# EasyEDA Pro project PPD.epro

# Schematic Schematic1
Board Name: Board1; Create Date: 2026-01-21; Page Name: P1; Project Name: pdd; Schematic Name: Schematic1; Update Date: 2026-01-24; Company: EasyEDA.com; Page Size: A4; Version: V1.0
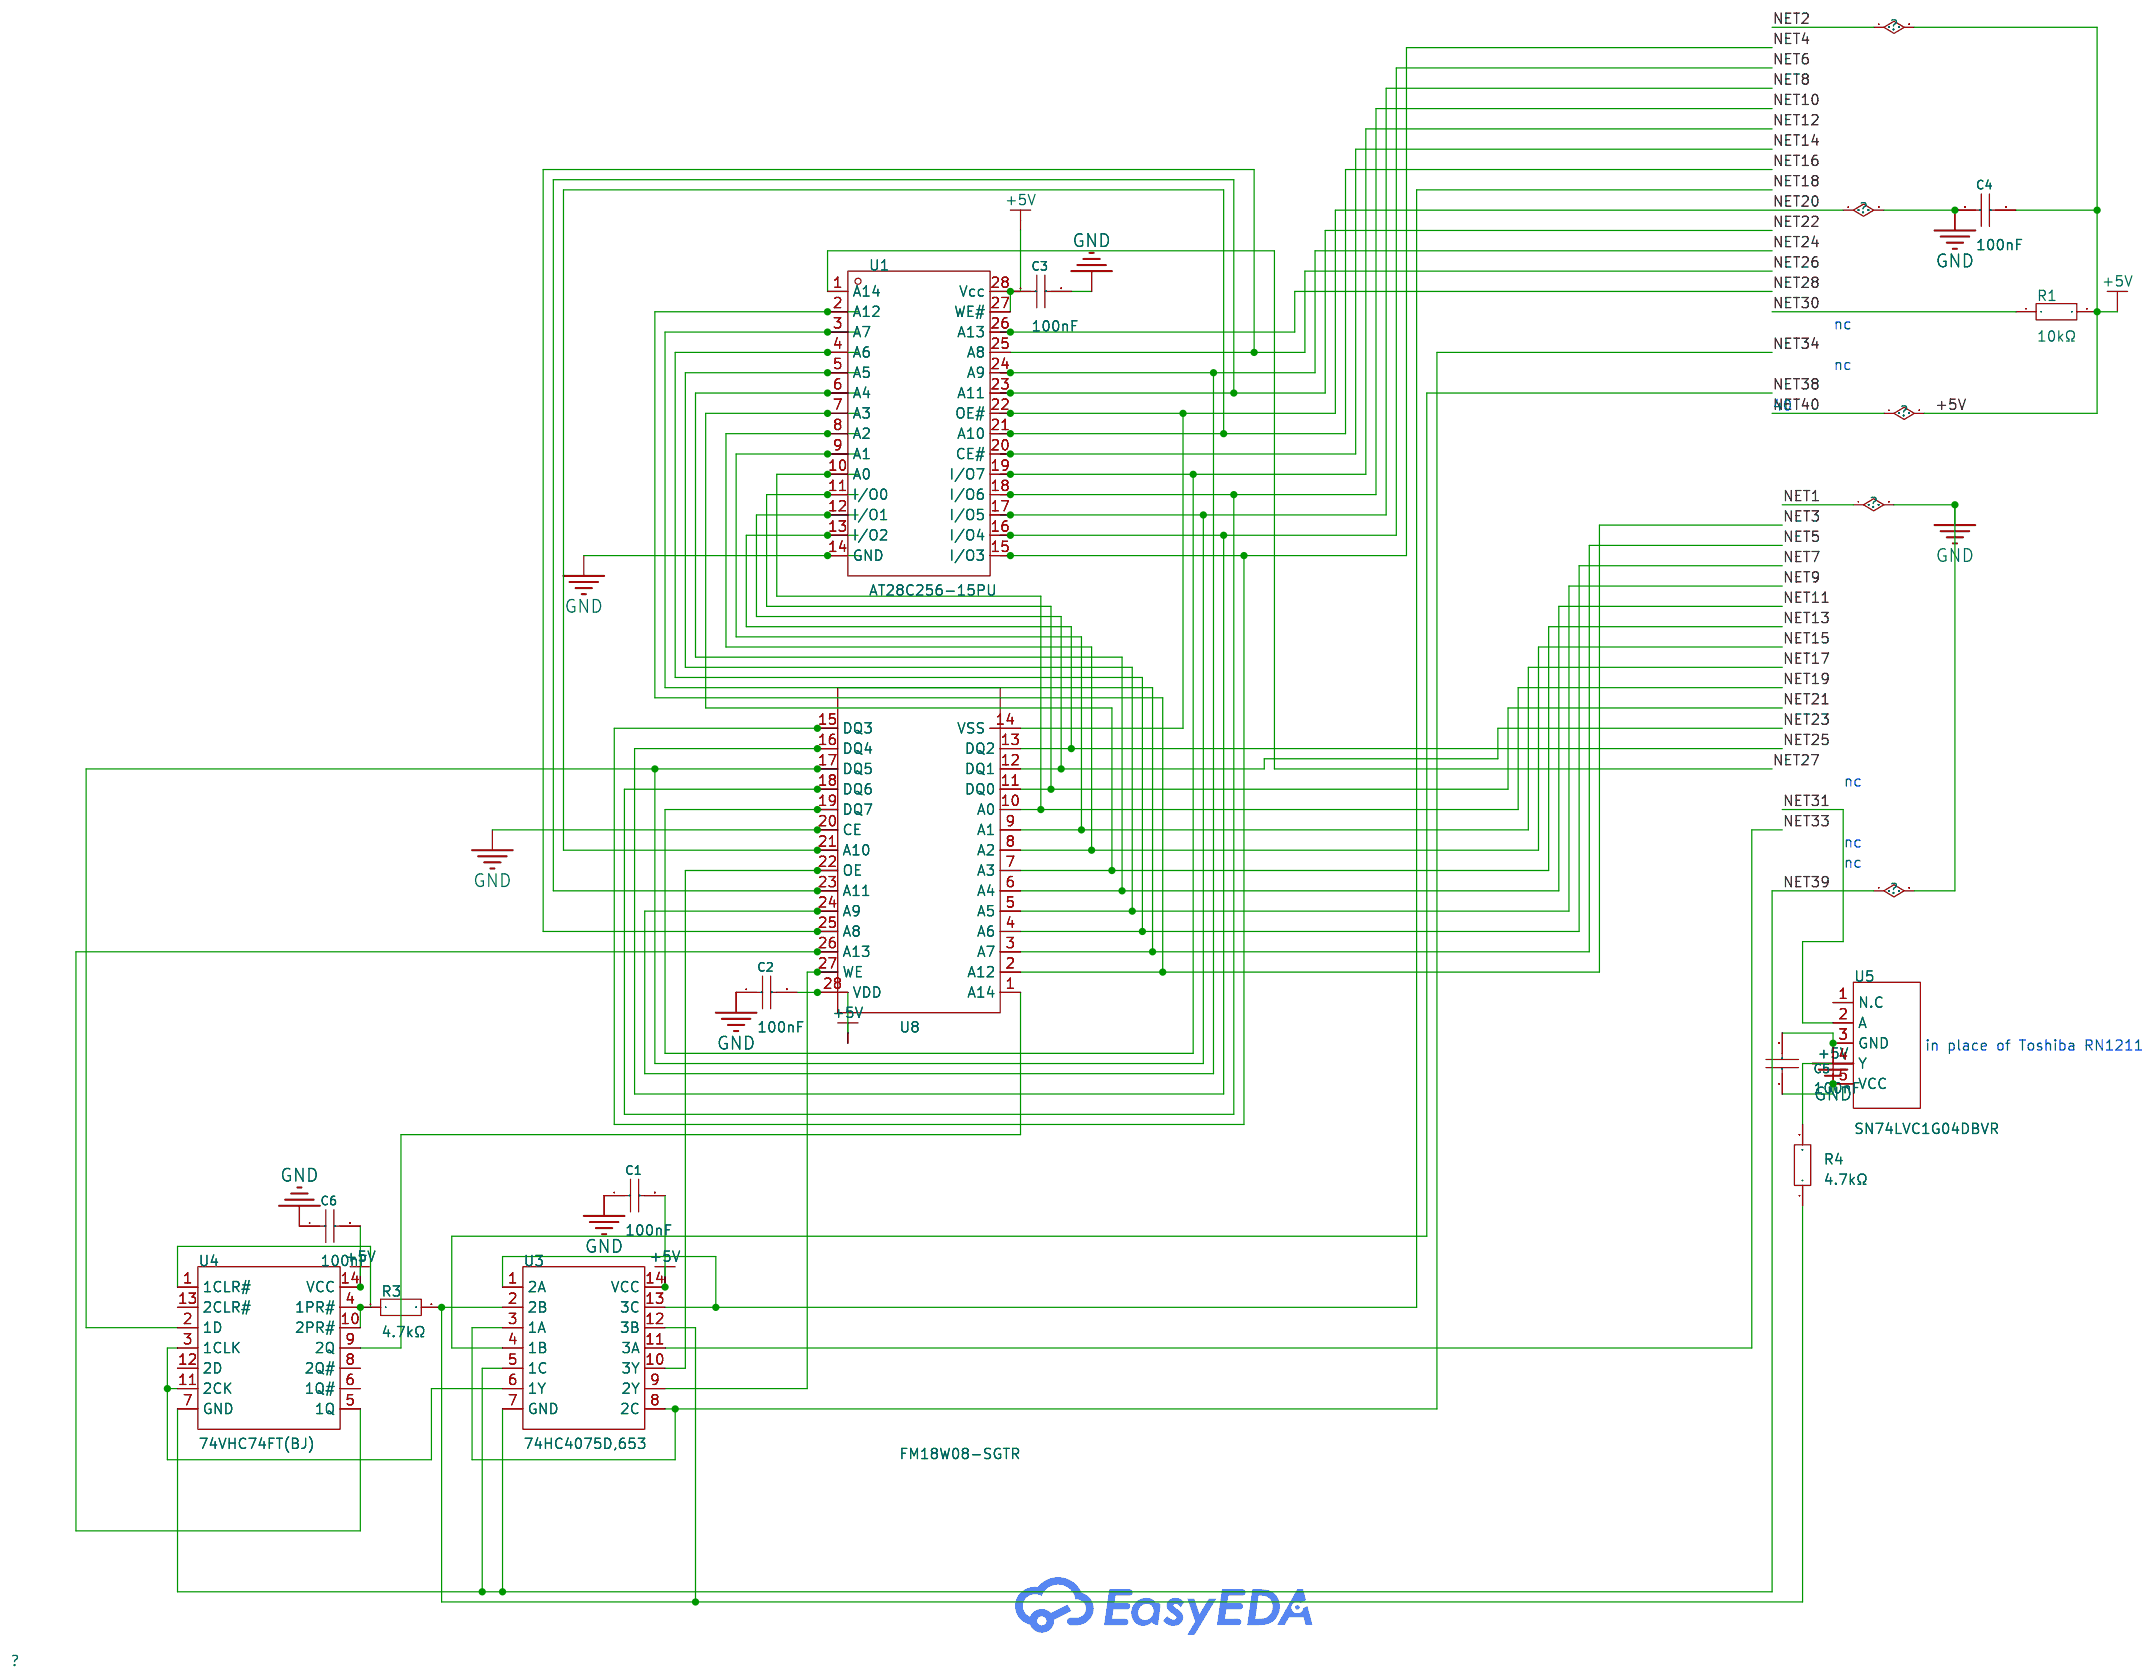
[diagram p0: schematic sheet]

## Parts
C1  100nF  [C0603]
C2  100nF  [C0603]
C3  100nF  [C0603]
C4  100nF  [C0603]
C5  100nF  [C0603]
C6  100nF  [C0603]
R1  10kΩ  [R0805]
R3  4.7kΩ  [R0805]
R4  4.7kΩ  [R0805]
U1  AT28C256-15PU  [PDIP-28_L37.0-W13.5-P2.54-LS15.6-BL]
U3  74HC4075D,653  [SO-14_L8.9-W3.9-P1.27-LS6.0-BL]
U4  74VHC74FT(BJ)  [TSSOP-14_L5.0-W4.4-P0.65-LS6.5-BL]
U5  SN74LVC1G04DBVR  [SOT-23-5_L3.0-W1.7-P0.95-LS2.8-BR]
U8  FM18W08-SGTR  [SOIC-28_L18.0-W7.5-P1.27-LS10.3-BL]

## Library data of the parts
C1-C6 = CL10B104JB8NNNC: Capacitance:100nF Tolerance:±5% Tolerance:±5% Voltage Rating:50V Temperature Coefficient:X7R; LCSC Part Name: 100nF ±5% 50V; Supplier Part: C24452; Manufacturer: SAMSUNG(三星); Supplier Footprint: 0603; JLCPCB Part Class: Extended Part; Datasheet: https://item.szlcsc.com/datasheet/CL10B104JB8NNNC/25192.html; Supplier: LCSC; Tolerance: ±5%; Voltage Rating: 50V; Temperature Coefficient: X7R
R1 = RT0805BRD0710KL: Type:Thin Film Resistor Resistance:10kΩ Tolerance:±0.1% Tolerance:±0.1% Power(Watts):125mW Voltage-Supply(Max):150V Temperature Coefficient:±25ppm/℃ Temperature Coefficient:±25ppm/℃ Operating Temperature:-55℃~+155℃ Operating Temperature:-55℃~+155℃; LCSC Part Name: 薄膜电阻 10kΩ ±0.1% 125mW; Supplier Part: C110775; Manufacturer: YAGEO(国巨); Supplier Footprint: 0805; JLCPCB Part Class: Extended Part; Datasheet: https://item.szlcsc.com/datasheet/RT0805BRD0710KL/112000.html; Supplier: LCSC; Type: Thin Film Resistor; Tolerance: ±0.1%; Power(Watts): 125mW; Voltage-Supply(Max): 150V; Temperature Coefficient: ±25ppm/℃; Operating Temperature: -55℃~+155℃
R3 R4 = 0805W8F4701T5E: Type:Thick Film Resistors Resistance:4.7kΩ Tolerance:±1% Tolerance:±1% Power(Watts): Overload Voltage (Max): Temperature Coefficient:±100ppm/℃ Temperature Coefficient:±100ppm/℃ Operating Temperature Range:-55℃~+155℃ Operating Temperature Range:-55℃~+155℃; LCSC Part Name: 4.7kΩ ±1% 125mW 厚膜电阻; Supplier Part: C17673; Manufacturer: UNI-ROYAL(厚声); Supplier Footprint: 0805; JLCPCB Part Class: Basic Part; Datasheet: https://atta.szlcsc.com/upload/public/pdf/source/20200306/C422600_1E6D84923E4A46A82E41ADD87F860B5C.pdf; Supplier: LCSC; Type: Thick Film Resistors; Tolerance: ±1%; Temperature Coefficient: ±100ppm/℃; Operating Temperature Range: -55℃~+155℃
U1 = AT28C256-15PU: Interface:Parallel Memory Size:256Kbit Voltage - Supply:4.5V~5.5V Voltage - Supply:4.5V~5.5V Write Cycle Time(Tw):10ms Data Retention - TDR (Year):10 Years Write Cycle Endurance:100,000 Cycles Operating Temperature:-40℃~+85℃ Operating Temperature:-40℃~+85; LCSC Part Name: AT28C256 15PU; Supplier Part: C1348752; Manufacturer: MICROCHIP(美国微芯); Supplier Footprint: PDIP-28; JLCPCB Part Class: Extended Part; Datasheet: https://item.szlcsc.com/datasheet/AT28C256-15PU/1439035.html; Supplier: LCSC; Interface: Parallel; Memory Size: 256Kbit; Voltage - Supply: 4.5V~5.5V; Write Cycle Time(Tw): 10ms; Data Retention - TDR (Year): 10 Years; Write Cycle Endurance: 100,000 Cycles; Operating Temperature: -40℃~+85℃
U3 = 74HC4075D,653: Logic Type:OR Gate Number of Channels:3 Voltage - Supply:2V~6V Voltage - Supply:2V~6V Quiescent Current:2uA Current - Output Low(IOL):5.2mA Current - Output High(IOH):5.2mA Input Logic Level - High:1.5V~4.2V Input Logic Level - High:1.5V~4.2V Input Logic; Supplier Part: C547041; Manufacturer: Nexperia(安世); Supplier Footprint: SO-14; JLCPCB Part Class: Extended Part; Datasheet: https://item.szlcsc.com/datasheet/74HC4075D%252C653/568171.html; Supplier: LCSC; Logic Type: OR Gate; Number of Channels: 3; Voltage - Supply: 2V~6V; Quiescent Current: 2uA; Current - Output Low(IOL): 5.2mA; Current - Output High(IOH): 5.2mA; Input Logic Level - High: 1.5V~4.2V; Input Logic Level - Low: 500mV~1.8V; Series: 74HCSeries; Propagation Delay: 17ns@6V,50pF; Operating Temperature: -40℃~+125℃
U4 = 74VHC74FT(BJ): Supplier Part: C7421300; Manufacturer: TOSHIBA(东芝); Supplier Footprint: TSSOP14B; JLCPCB Part Class: Extended Part; Datasheet: https://item.szlcsc.com/datasheet/74VHC74FT(BJ)/8401554.html; Supplier: LCSC
U5 = SN74LVC1G04DBVR: Supply Voltage(Single):1.65V~5.5V Supply Voltage(Single):1.65V~5.5V Supply Current (Max):10uA Number of Circuits:1 Number of Inputs:1 Sink Current:32mA Source Current:32mA High level range (VIH):1.7V~2V High level range (VIH):1.7V~2V Low level range (VIL); LCSC Part Name: 单路反向器; Supplier Part: C7827; Manufacturer: TI(德州仪器); Supplier Footprint: SOT-23-5; JLCPCB Part Class: Extended Part; Datasheet: https://www.ti.com/cn/lit/gpn/sn74lvc1g04; Supplier: LCSC; Supply Voltage(Single): 1.65V~5.5V; Supply Current (Max): 10uA; Number of Circuits: 1; Number of Inputs: 1; Sink Current: 32mA; Source Current: 32mA; High level range (VIH): 1.7V~2V; Low level range (VIL): 700mV~800mV; Max Propagation Delay: 3.7ns@5V,50pF; Series: 74LVCSeries; Operating Temperature: -40℃~+125℃
U8 = FM18W08-SGTR: Interface Type:Parallel Port Memory Size:256Kbit Supply Voltage:2.7V~5.5V Supply Voltage:2.7V~5.5V Supply Current:12mA Clock Frequency (fc):- Standby supply current (Isb):20uA Sleep mode current (Izz):- Operating Temperature:-40℃~+85℃ Operating Temperatur; Supplier Part: C55945; Manufacturer: Infineon/CYPRESS(赛普拉斯); Supplier Footprint: SOIC-28-300mil; JLCPCB Part Class: Extended Part; Datasheet: https://atta.szlcsc.com/upload/public/pdf/source/20150821/1457707347973.pdf; Supplier: LCSC; Interface Type: Parallel Port; Memory Size: 256Kbit; Supply Voltage: 2.7V~5.5V; Supply Current: 12mA; Standby supply current (Isb): 20uA; Operating Temperature: -40℃~+85℃

## Nets
+5V: C1.2 C2.2 C3.1 C4.2 C5.1 C6.2 R1.2 U1.27(WE#) U1.28(Vcc) U3.14(VCC) U4.14(VCC) U5.5(VCC) U8.28(VDD)
GND: C1.1 C2.1 C3.2 C4.1 C5.2 C6.1 U1.14(GND) U1.22(OE#) U3.5(1C) U3.7(GND) U4.7(GND) U5.3(GND) U8.14(VSS) U8.20(CE)
NET3: U1.2(A12) U8.2(A12)
NET4: U1.15(I/O3) U8.15(DQ3)
NET5: U1.3(A7) U8.3(A7)
NET6: U1.16(I/O4) U8.16(DQ4)
NET7: U1.4(A6) U8.4(A6)
NET8: U1.17(I/O5) U4.2(1D) U8.17(DQ5)
NET9: U1.5(A5) U8.5(A5)
NET10: U1.18(I/O6) U8.18(DQ6)
NET11: U1.6(A4) U8.6(A4)
NET12: U1.19(I/O7) U8.19(DQ7)
NET13: U1.7(A3) U8.7(A3)
NET14: U1.20(CE#)
NET15: U1.8(A2) U8.8(A2)
NET16: U1.21(A10) U8.21(A10)
NET17: U1.9(A1) U8.9(A1)
NET18: U3.1(2A) U3.13(3C)
NET19: U1.10(A0) U8.10(A0)
NET21: U1.11(I/O0) U8.11(DQ0)
NET22: U1.23(A11) U8.23(A11)
NET23: U1.12(I/O1) U8.12(DQ1)
NET24: U1.24(A9) U8.24(A9)
NET25: U1.13(I/O2) U8.13(DQ2)
NET26: U1.25(A8) U8.25(A8)
NET27: U1.1(A14)
NET28: U1.26(A13)
NET30: R1.1
NET31: U5.2(A)
NET33: U3.11(3A)
NET34: U3.3(1A) U3.8(2C)
NET38: U3.4(1B)
$1N1759: U4.5(1Q) U8.26(A13)
$1N1852: U4.9(2Q) U8.1(A14)
$1N2115: R3.1 U4.1(1CLR#) U4.4(1PR#) U4.10(2PR#)
$1N2536: U3.10(3Y) U8.22(OE)
$1N2667: U3.6(1Y) U4.3(1CLK) U4.11(2CK)
$1N3512: R4.2 U5.4(Y)
$1N3520: R3.2 R4.1 U3.2(2B) U3.12(3B)
$1N5475: U3.9(2Y) U8.27(WE)

Not connected (* = marked no-connect by the designer): U4 6(1Q#) 8(2Q#) 12(2D) 13(2CLR#); U5 1(N.C)

## Notes on the sheet
- nc
- nc
- 40
- nc
- nc
- nc
- in place of Toshiba RN1211

# Board PCB1
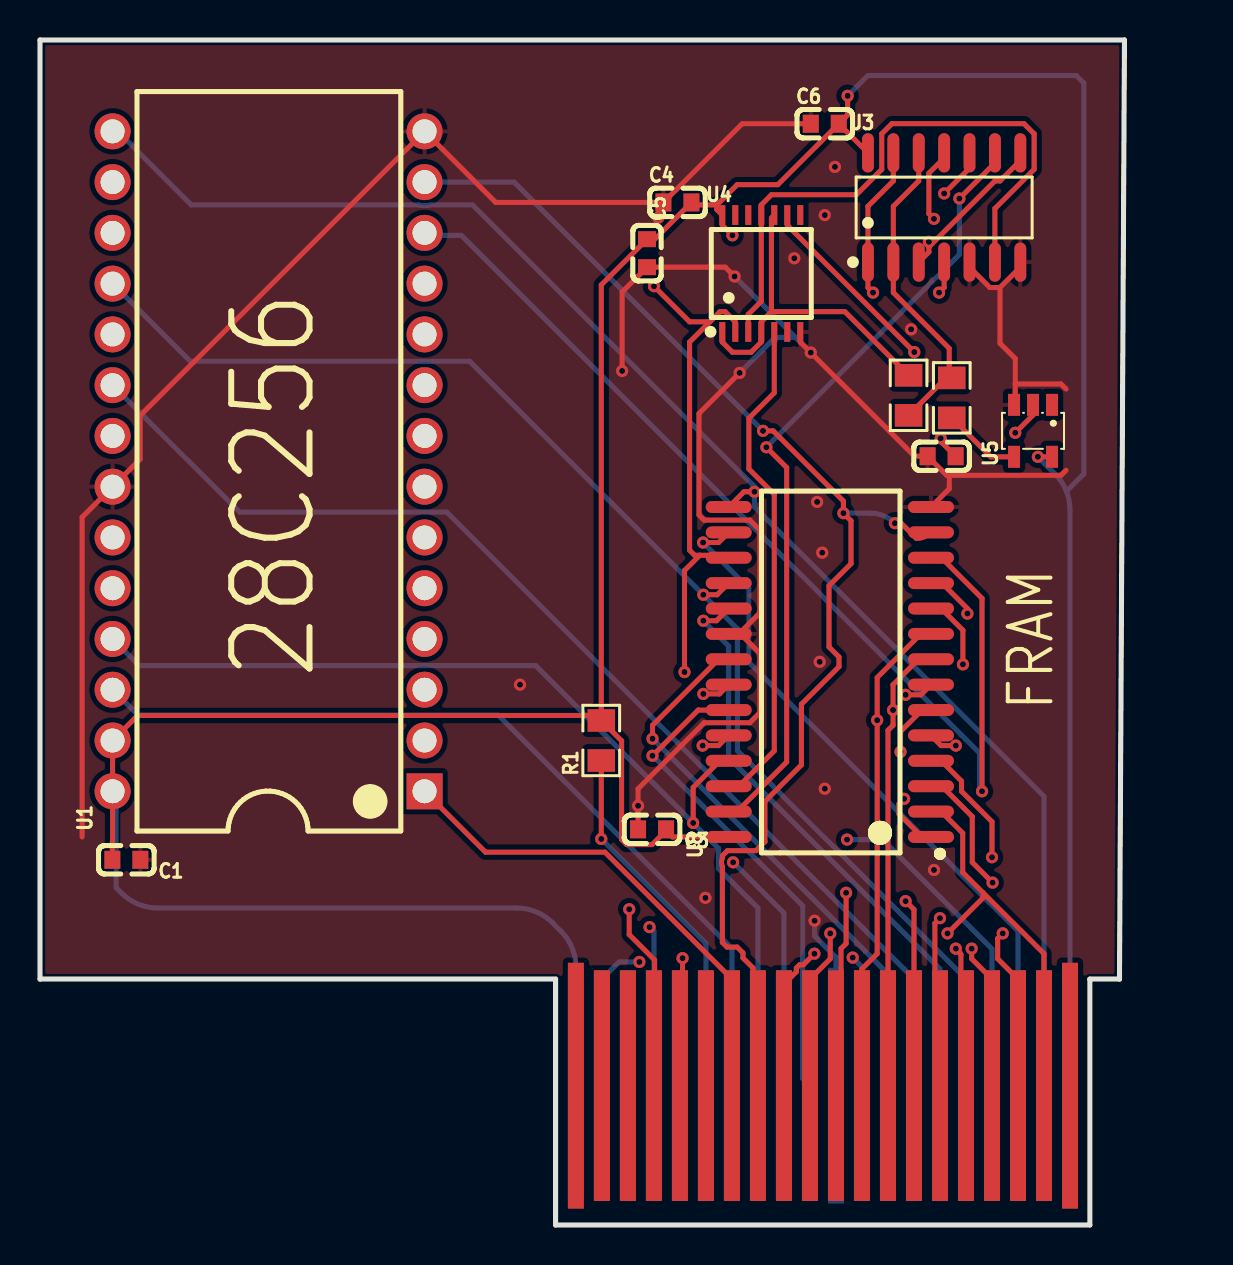
[diagram p1: board, top side]
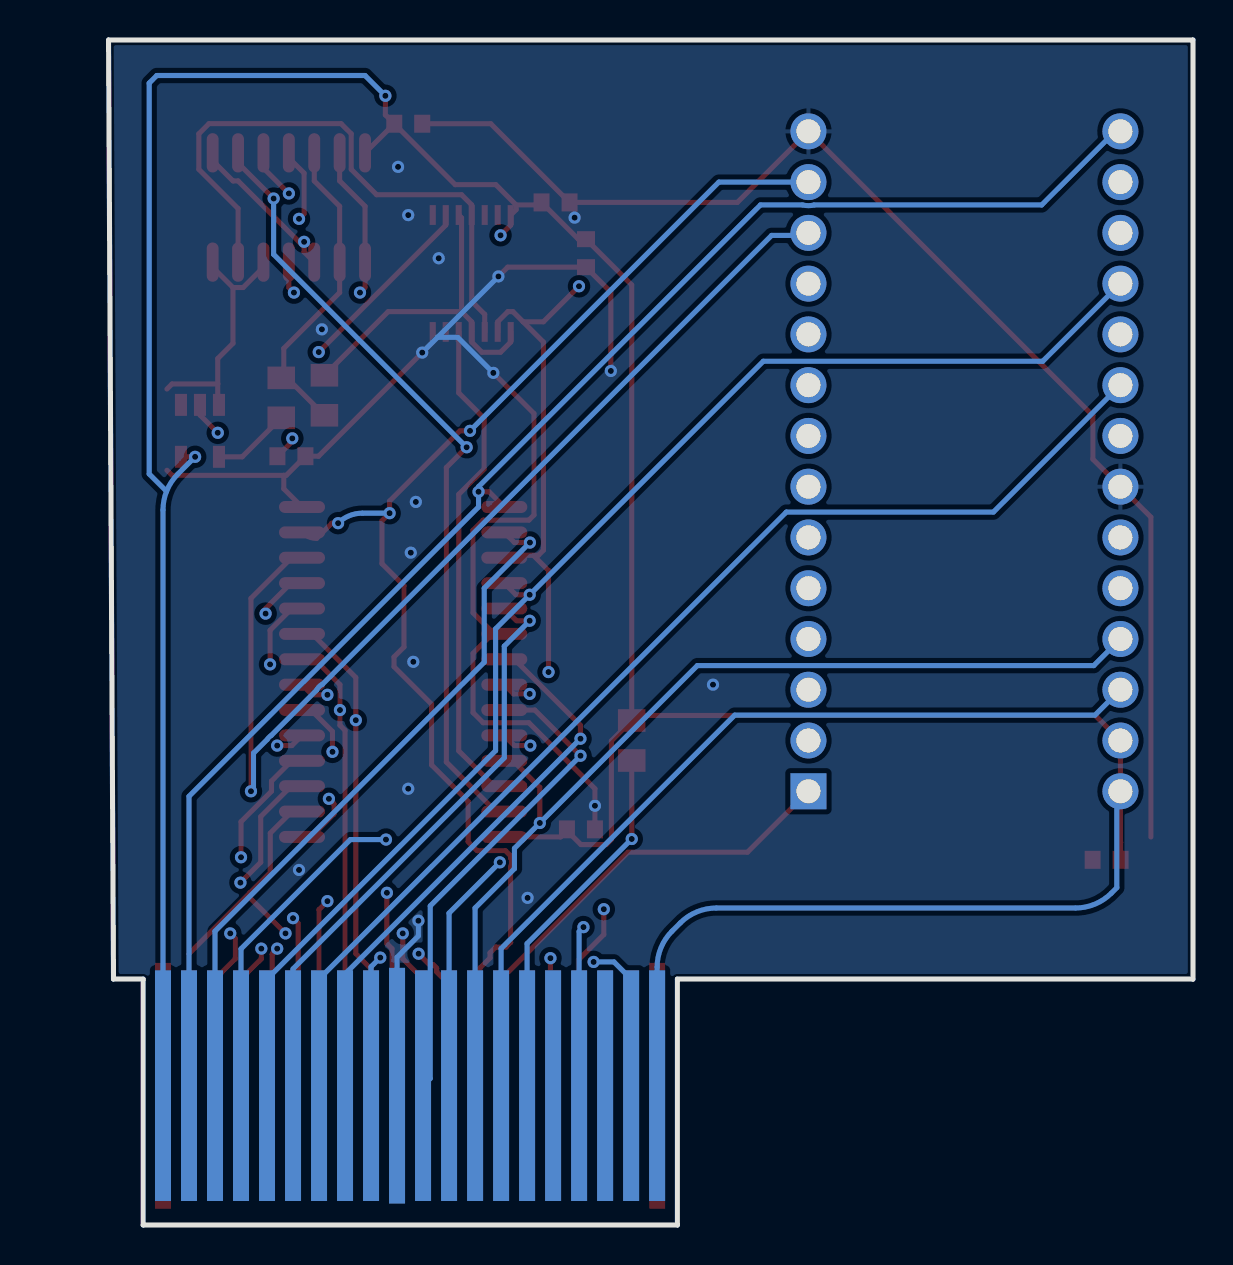
[diagram p2: board, bottom side, seen from below]

Outline 54.23 x 59.3 mm; copper layers: Top Layer, Inner1, Inner2, Bottom Layer. Coordinates in mm from the lower left corner of the outline.
Outline path: 0,59.3 0,12.31 25.78,12.31 25.78,0 52.5,0 52.5,12.31 53.98,12.31 54.23,59.3 0,59.3
Stack: Top Layer 0.035mm Outer layer thickness 1oz / Dielectric1 0.2104mm 7628 RC49% 8.6mil / Inner1 0.0152mm Inner layer thickness / Dielectric2 1.065mm 1.1mm H/HOZ Copper / Inner2 0.0152mm Inner layer thickness / Dielectric3 0.2104mm 7628 RC49% 8.6mil / Bottom Layer 0.035mm Outer layer thickness 1oz

## Design rules (mm)
template: JLCPCB Capability(Two Layers Board)
spacing copperThickness1oz (default): track to track 0.102, other pairs 0.152 to 0.3
spacing copperThickness2oz: track to track 0.203, other pairs 0.152 to 0.3
track width copperThickness1oz (default): min 0.127, default 0.254, max 2.54
track width copperThickness2oz: min 0.203, default 0.254, max 2.54
differential pair differentialPair (default): width min 0.127, default 0.254, max 2.54; gap min 0.152, default 0.152
via viaSize (default): diameter min 0.5, default 0.61, max 10; hole min 0.3, default 0.305, max 6.3

## Placement (name value [footprint] x y rotation side)
C1  100nF  [C0603]  4.32 18.27 180 top
C2  100nF  [C0603]  45.08 38.47 0 top
C3  100nF  [C0603]  30.61 19.8 180 top
C4  100nF  [C0603]  31.88 51.17 0 top
C5  100nF  [C0603]  30.35 48.63 270 top
C6  100nF  [C0603]  39.24 55.1 0 top
NOREF  -  [Pad_e5638]  33.3 6.97 0 top
NOREF#2  -  [Pad_e11218]  37.2 6.97 0 top
NOREF#3  -  [Pad_e5650]  48.9 6.97 0 top
NOREF#4  -  [Pad_e11221]  41.1 6.97 0 top
NOREF#5  -  [Pad_e5639]  34.6 6.97 0 top
NOREF#6  -  [Pad_e5635]  29.4 6.97 0 top
NOREF#7  -  [Pad_e5637]  32 6.97 0 top
NOREF#8  -  [Pad_e5636]  30.7 6.97 0 top
NOREF#9  -  [Pad_e11211]  28.1 6.97 0 top
NOREF#10  -  [Pad_e5643]  39.8 6.97 0 top
NOREF#11  -  [Pad_e5634]  28.1 6.97 0 top
NOREF#12  -  [Pad_e5647]  45 6.97 0 top
NOREF#13  -  [Pad_e11220]  39.8 6.97 0 top
NOREF#14  -  [Pad_e11213]  30.7 6.97 0 top
NOREF#15  -  [Pad_e5642]  38.5 6.97 0 top
NOREF#16  -  [Pad_e5644]  41.1 6.97 0 top
NOREF#17  -  [Pad_e5646]  43.7 6.97 0 top
NOREF#18  -  [Pad_e11227]  48.9 6.97 0 top
NOREF#19  -  [Pad_e5651]  50.21 6.97 0 top
NOREF#20  -  [Pad_e11226]  47.6 6.97 0 top
NOREF#21  -  [Pad_e11219]  38.5 6.97 0 top
NOREF#22  -  [Pad_e5648]  46.3 6.97 0 top
NOREF#23  -  [Pad_e11223]  43.7 6.97 0 top
NOREF#24  -  [Pad_e5649]  47.6 6.97 0 top
NOREF#25  -  [Pad_e11224]  45 6.97 0 top
NOREF#26  -  [Pad_e11215]  33.3 6.97 0 top
NOREF#27  -  [Pad_e5594]  26.8 6.97 0 top
NOREF#28  -  [Pad_e11225]  46.3 6.97 0 top
NOREF#29  -  [Pad_e5652]  51.51 6.97 0 top
NOREF#30  -  [Pad_e11217]  35.9 6.97 0 top
NOREF#31  -  [Pad_e11214]  32 6.97 0 top
NOREF#32  -  [Pad_e11229]  51.51 6.97 0 top
NOREF#33  -  [Pad_e5640]  35.9 6.97 0 top
NOREF#34  -  [Pad_e5645]  42.4 6.97 0 top
NOREF#35  -  [Pad_e5641]  37.2 6.97 0 top
NOREF#36  -  [Pad_e11222]  42.4 6.97 0 top
NOREF#37  -  [Pad_e11210]  26.8 6.97 0 top
NOREF#38  -  [Pad_e11212]  29.4 6.97 0 top
NOREF#39  -  [Pad_e11216]  34.6 6.97 0 top
NOREF#40  -  [Pad_e11228]  50.21 6.97 0 top
R1  10kΩ  [R0805]  28.07 24.24 90 top
R3  4.7kΩ  [R0805]  43.43 41.52 270 top
R4  4.7kΩ  [R0805]  45.59 41.39 270 top
U1  AT28C256-15PU  [PDIP-28_L37.0-W13.5-P2.54-LS15.6-BL]  11.43 38.21 90 top
U3  74HC4075D,653  [SO-14_L8.9-W3.9-P1.27-LS6.0-BL]  45.21 50.91 0 top
U4  74VHC74FT(BJ)  [TSSOP-14_L5.0-W4.4-P0.65-LS6.5-BL]  36.07 47.61 0 top
U5  SN74LVC1G04DBVR  [SOT-23-5_L3.0-W1.7-P0.95-LS2.8-BR]  49.66 39.74 90 top
U8  FM18W08-SGTR  [SOIC-28_L18.0-W7.5-P1.27-LS10.3-BL]  39.5 27.67 90 top

## Footprints (pads in the part's own frame, mm; a bottom-side part is the same pattern mirrored in y, then rotated)
C0603
  rect 0.8x0.9 smd: 1(-0.7,0) 2(0.7,0)
Pad_e5594
  rect 0.8x12.301 smd: 39(0,0)
Pad_e5634
  rect 0.8x11.539 smd: 40(0,0)
Pad_e5635
  rect 0.8x11.539 smd: 41(0,0)
Pad_e5636
  rect 0.8x11.539 smd: 42(0,0)
Pad_e5637
  rect 0.8x11.539 smd: 43(0,0)
Pad_e5638
  rect 0.8x11.539 smd: 44(0,0)
Pad_e5639
  rect 0.8x11.539 smd: 45(0,0)
Pad_e5640
  rect 0.8x11.539 smd: 46(0,0)
Pad_e5641
  rect 0.8x11.539 smd: 47(0,0)
Pad_e5642
  rect 0.8x11.539 smd: 48(0,0)
Pad_e5643
  rect 0.8x11.539 smd: 49(0,0)
Pad_e5644
  rect 0.8x11.539 smd: 50(0,0)
Pad_e5645
  rect 0.8x11.539 smd: 51(0,0)
Pad_e5646
  rect 0.8x11.539 smd: 52(0,0)
Pad_e5647
  rect 0.8x11.539 smd: 53(0,0)
Pad_e5648
  rect 0.8x11.539 smd: 54(0,0)
Pad_e5649
  rect 0.8x11.539 smd: 55(0,0)
Pad_e5650
  rect 0.8x11.539 smd: 56(0,0)
Pad_e5651
  rect 0.8x11.539 smd: 57(0,0)
Pad_e5652
  rect 0.8x12.301 smd: 58(0,0)
Pad_e11210
  rect 0.8x11.539 smd far side: 80(0,0)
Pad_e11211
  rect 0.8x11.539 smd far side: 40(0,0)
Pad_e11212
  rect 0.8x11.539 smd far side: 41(0,0)
Pad_e11213
  rect 0.8x11.539 smd far side: 42(0,0)
Pad_e11214
  rect 0.8x11.539 smd far side: 43(0,0)
Pad_e11215
  rect 0.8x11.539 smd far side: 44(0,0)
Pad_e11216
  rect 0.8x11.539 smd far side: 45(0,0)
Pad_e11217
  rect 0.8x11.539 smd far side: 46(0,0)
Pad_e11218
  rect 0.8x11.539 smd far side: 47(0,0)
Pad_e11219
  rect 0.8x11.539 smd far side: 48(0,0)
Pad_e11220
  rect 0.8x11.793 smd far side: 49(0,0)
Pad_e11221
  rect 0.8x11.539 smd far side: 50(0,0)
Pad_e11222
  rect 0.8x11.539 smd far side: 51(0,0)
Pad_e11223
  rect 0.8x11.539 smd far side: 52(0,0)
Pad_e11224
  rect 0.8x11.539 smd far side: 53(0,0)
Pad_e11225
  rect 0.8x11.539 smd far side: 54(0,0)
Pad_e11226
  rect 0.8x11.539 smd far side: 55(0,0)
Pad_e11227
  rect 0.8x11.539 smd far side: 56(0,0)
Pad_e11228
  rect 0.8x11.539 smd far side: 57(0,0)
Pad_e11229
  rect 0.8x11.539 smd far side: 58(0,0)
PDIP-28_L37.0-W13.5-P2.54-LS15.6-BL
  rect 1.8x1.8 hole 1.2: 1(-16.51,-7.8)
  round 1.8 hole 1.2: 2(-13.97,-7.8) 3(-11.43,-7.8) 4(-8.89,-7.8) 5(-6.35,-7.8) 6(-3.81,-7.8) 7(-1.27,-7.8) 8(1.27,-7.8) 9(3.81,-7.8) 10(6.35,-7.8) 11(8.89,-7.8) 12(11.43,-7.8) 13(13.97,-7.8) 14(16.51,-7.8) 15(16.51,7.8) 16(13.97,7.8) 17(11.43,7.8) 18(8.89,7.8) 19(6.35,7.8) 20(3.81,7.8) 21(1.27,7.8) 22(-1.27,7.8) 23(-3.81,7.8) 24(-6.35,7.8) 25(-8.89,7.8) 26(-11.43,7.8) 27(-13.97,7.8) 28(-16.51,7.8)
R0805
  rect 1.133x1.377 smd: 1(-1,0) 2(1,0)
SO-14_L8.9-W3.9-P1.27-LS6.0-BL
  oval 0.595x1.968 smd: 1(-3.81,-2.734) 2(-2.54,-2.734) 3(-1.27,-2.734) 4(0,-2.734) 5(1.27,-2.734) 6(2.54,-2.734) 7(3.81,-2.734) 8(3.81,2.734) 9(2.54,2.734) 10(1.27,2.734) 11(0,2.734) 12(-1.27,2.734) 13(-2.54,2.734) 14(-3.81,2.734)
SOIC-28_L18.0-W7.5-P1.27-LS10.3-BL
  oval 0.6x2.3 smd: 1(-8.255,-5.058) 2(-6.985,-5.058) 3(-5.715,-5.058) 4(-4.445,-5.058) 5(-3.175,-5.058) 6(-1.905,-5.058) 7(-0.635,-5.058) 8(0.635,-5.058) 9(1.905,-5.058) 10(3.175,-5.058) 11(4.445,-5.058) 12(5.715,-5.058) 13(6.985,-5.058) 14(8.255,-5.058) 15(8.255,5.058) 16(6.985,5.058) 17(5.715,5.058) 18(4.445,5.058) 19(3.175,5.058) 20(1.905,5.058) 21(0.635,5.058) 22(-0.635,5.058) 23(-1.905,5.058) 24(-3.175,5.058) 25(-4.445,5.058) 26(-5.715,5.058) 27(-6.985,5.058) 28(-8.255,5.058)
SOT-23-5_L3.0-W1.7-P0.95-LS2.8-BR
  rect 1.1x0.6 smd: 1(1.3,-0.95) 2(1.3,0) 3(1.3,0.95) 4(-1.3,0.95) 5(-1.3,-0.95)
TSSOP-14_L5.0-W4.4-P0.65-LS6.5-BL
  rect 0.305x0.991 smd: 1(-1.95,-2.925) 2(-1.3,-2.925) 3(-0.65,-2.925) 4(0,-2.925) 5(0.65,-2.925) 6(1.3,-2.925) 7(1.95,-2.925) 8(1.95,2.925) 9(1.3,2.925) 10(0.65,2.925) 11(0,2.925) 12(-0.65,2.925) 13(-1.3,2.925) 14(-1.95,2.925)

## Nets
+5V: C1.2 C2.2 C3.1 C4.2 C5.1 C6.2 NOREF#32.58 NOREF#37.80 R1.2 U1.27 U1.28 U3.14 U4.14 U5.5 U8.28
GND: C1.1 C2.1 C3.2 C4.1 C5.2 C6.1 NOREF#13.49 NOREF#27.39 NOREF#29.58 U1.14 U1.22 U3.5 U3.7 U4.7 U5.3 U8.14 U8.20
NET3: NOREF#19.57 U1.2 U8.2
NET4: NOREF#40.57 U1.15 U8.15
NET5: NOREF#3.56 U1.3 U8.3
NET6: NOREF#18.56 U1.16 U8.16
NET7: NOREF#24.55 U1.4 U8.4
NET8: NOREF#20.55 U1.17 U4.2 U8.17
NET9: NOREF#22.54 U1.5 U8.5
NET10: NOREF#28.54 U1.18 U8.18
NET11: NOREF#12.53 U1.6 U8.6
NET12: NOREF#25.53 U1.19 U8.19
NET13: NOREF#17.52 U1.7 U8.7
NET14: NOREF#23.52 U1.20
NET15: NOREF#34.51 U1.8 U8.8
NET16: NOREF#36.51 U1.21 U8.21
NET17: NOREF#16.50 U1.9 U8.9
NET18: NOREF#4.50 U3.1 U3.13
NET19: NOREF#10.49 U1.10 U8.10
NET21: NOREF#15.48 U1.11 U8.11
NET22: NOREF#21.48 U1.23 U8.23
NET23: NOREF#35.47 U1.12 U8.12
NET24: NOREF#2.47 U1.24 U8.24
NET25: NOREF#33.46 U1.13 U8.13
NET26: NOREF#30.46 U1.25 U8.25
NET27: NOREF#5.45 U1.1
NET28: NOREF#39.45 U1.26
NET29: NOREF.44
NET30: NOREF#26.44 R1.1
NET31: NOREF#7.43 U5.2
NET32: NOREF#31.43
NET33: NOREF#8.42 U3.11
NET34: NOREF#14.42 U3.3 U3.8
NET35: NOREF#6.41
NET36: NOREF#38.41
NET37: NOREF#11.40
NET38: NOREF#9.40 U3.4
$1N1759: U4.5 U8.26
$1N1852: U4.9 U8.1
$1N2115: R3.1 U4.1 U4.4 U4.10
$1N2536: U3.10 U8.22
$1N2667: U3.6 U4.3 U4.11
$1N3512: R4.2 U5.4
$1N3520: R3.2 R4.1 U3.2 U3.12
$1N5475: U3.9 U8.27

Pads without a net: U4 6 8 12 13; U5 1

## Via types
v1: diameter 0.61, hole 0.305, Top Layer to Bottom Layer, 73 vias

## Routing (per net, layer and track width the routed paths; a pad name or vN(x,y) marks a point on that pad's centre or on a via; arc(x,y) is an arc through that point)
+5V: length 208.7
  Top Layer w0.254: v1(34.63,49.52) 34.12,50.03 U4.14 33.85,50.81 33.85,51.04 ; C6.2 40.39,55.55 v1(40.39,56.5) ; C6.2 U3.14 ; C6.2 36.89,52.06 34.86,52.06 33.85,51.04 ; 33.85,51.04 32.7,51.04 C4.2 30.74,49.33 C5.1 28.07,47.04 R1.2 ; R1.2 27.81,25.5 4.88,25.5 3.63,24.24 3.63,19.18 3.62,19.16 C1.2 ; R1.2 29.08,24.23 29.08,19.29 29.34,19.04 30.61,19.04 31.31,19.74 ; v1(45.04,39.36) 45.04,39.21 C2.2 ; 31.31,19.74 C3.1 ; 31.31,19.74 31.63,19.42 U8.28 ; v1(49.9,38.44) U5.5
  Inner1 w0.254: v1(49.9,38.44) 45.96,38.44 v1(45.04,39.36)
  Inner2 w0.254: v1(45.04,39.36) 44.79,39.36 v1(34.63,49.52)
  Bottom Layer w0.254: 51.33,36.71 52.2,37.58 52.2,57.14 51.82,57.52 41.4,57.52 v1(40.39,56.5) ; 51.33,36.71 arc(51.09,37.17) 50.76,37.58 v1(49.9,38.44) ; 51.33,36.71 arc(51.46,36.25) 51.51,35.78 NOREF#32.58 ; NOREF#37.80 26.8,12.9 arc(26.6,13.88) 26.05,14.7 25.64,15.12 arc(24.81,15.67) 23.84,15.86 5.88,15.86 arc(4.91,16.06) 4.08,16.61 3.81,16.88 3.81,21.27 arc(3.76,21.5) 3.63,21.7
GND: length 161.5
  Top Layer w0.254: v1(30.92,50.41) 30.92,50.91 C4.1 ; U8.20 34.48,29.62 34.99,29.62 ; 48.77,42.08 48.77,41.1 U5.3 ; 48.77,42.08 51.05,42.08 51.31,41.83 ; 48.77,42.08 48.77,43.35 48.01,44.12 48.01,46.91 ; v1(34.99,42.64) 32.95,40.61 32.95,35.53 33.21,35.27 35.49,35.27 36,34.76 36,30.63 34.99,29.62 ; C6.1 35.11,55.1 C4.1 ; 45.47,37.51 51.05,37.51 51.31,37.77 ; 45.47,37.51 45.34,37.51 C2.1 43.73,38.47 v1(38.54,43.65) 38.02,44.18 U4.7 ; 45.47,37.51 45.47,36.84 U8.14 ; v1(29.11,42.73) 29.11,46.69 C5.2 34.27,47.93 v1(34.73,47.46) ; 48.01,46.91 49.02,47.93 U3.7 ; 48.01,46.91 47.5,46.91 46.48,47.93 U3.5 ; 34.99,29.62 36,28.6 36,25.64 35.49,25.13 33.21,25.13 29.91,21.83 v1(29.91,20.98) C3.2 ; C4.1 22.79,51.17 U1.14 5.01,40.5 5.01,38.32 2.11,35.42 2.11,19.42
  Inner1 w0.254: v1(30.92,50.41) 33.86,47.46 v1(34.73,47.46)
  Bottom Layer w0.254: 37.78,44.42 v1(34.73,47.46) ; 37.78,44.42 v1(38.54,43.65) ; 37.78,44.42 36.77,44.42 v1(34.99,42.64) ; v1(38.73,15.23) 38.73,14.46 39.8,13.4 NOREF#13.49
  vias: v1(24,27.04) v1(33.27,16.37) v1(37.72,48.37) v1(38.86,36.18) v1(38.99,28.18) v1(39.12,33.64) v1(39.24,50.53) v1(39.24,21.83) v1(39.75,52.95) v1(43.56,44.82) v1(44.7,17.77)
NET3: length 51
  Top Layer w0.254: 47.16,16.62 50.21,13.58 NOREF#19.57 ; 47.16,16.62 47.16,16.37 v1(45.38,14.59) ; 47.16,16.62 46.14,17.64 46.14,19.61 45.06,20.69 U8.2
  Inner1 w0.254: U1.2 19.98,24.24 31.66,12.56 43.35,12.56 v1(45.38,14.59)
NET4: length 77
  Top Layer w0.254: U8.15 35.2,36.69 v1(35.73,36.69)
  Bottom Layer w0.254: NOREF#40.57 50.21,21.45 35.73,35.93 v1(35.73,36.69) 35.73,36.94 21.63,51.04 19.52,51.04 arc(19.23,51.01) 18.94,51.04 7.57,51.04 3.88,54.72 3.63,54.72
NET5: length 58.2
  Top Layer w0.254: v1(47.64,17.13) 46.62,18.15 46.62,20.43 45.1,21.96 U8.3 ; NOREF#3.56 48.9,12.31 47.89,13.32 47.89,14.34 v1(48.14,14.59)
  Inner1 w0.254: v1(47.64,17.13) 48.14,16.62 v1(48.14,14.59)
  Inner2 w0.254: U1.3 17.92,25.47 17.92,23.74 18.68,22.97 20.2,22.97 20.46,22.72 20.46,21.7 30.62,11.54 45.35,11.54 48.14,14.34 v1(48.14,14.59)
NET6: length 73
  Top Layer w0.254: U8.16 33.93,34.15 v1(33.16,34.15)
  Inner2 w0.254: 3.63,52.18 4.96,50.85 4.96,49.39 18.68,35.67 31.63,35.67 v1(33.16,34.15)
  Bottom Layer w0.254: v1(33.16,34.15) 35.44,31.86 35.44,28.16 48.9,14.7 NOREF#18.56
NET7: length 56.5
  Top Layer w0.254: v1(47.6,18.4) 47.6,20.18 46.08,21.7 46.08,22.21 45.06,23.23 U8.4 ; v1(46.59,13.83) 46.59,13.32 47.6,12.31 NOREF#24.55
  Inner2 w0.254: v1(47.6,18.4) 46.59,17.39 v1(46.59,13.83) 46.59,13.58 45.06,12.05 32.36,12.05 20.43,23.99 20.43,28.13 U1.4
NET8: length 82.6
  Top Layer w0.254: U4.2 34.77,45.19 34.26,45.7 34.01,45.7 33.5,45.19 ; 33.5,45.19 32.48,45.19 v1(30.7,46.97) ; 33.5,45.19 32.48,44.18 32.48,33.77 32.74,33.51 32.99,33.51 ; U8.17 34.32,33.51 32.99,33.51 ; 32.99,33.51 32.23,32.75 v1(32.23,27.67)
  Inner1 w0.254: 3.63,49.64 4.9,48.37 29.3,48.37 v1(30.7,46.97)
  Inner2 w0.254: v1(32.23,27.67) 32.23,26.65 39.59,19.29 v1(40.36,19.29)
  Bottom Layer w0.254: NOREF#20.55 47.6,13.82 42.13,19.29 v1(40.36,19.29)
NET9: length 48.7
  Top Layer w0.254: NOREF#22.54 46.3,7.23 46.05,7.48 46.05,13.54 46,13.59 46,13.62 v1(45.8,13.83) ; U8.5 45.06,23.99 v1(45.8,23.99)
  Inner1 w0.254: v1(45.8,23.99) 45.8,23.23 46.05,22.97 46.05,14.08 v1(45.8,13.83)
  Inner2 w0.254: v1(45.8,23.99) 45.29,24.5 37.92,24.5 30.56,31.86 U1.5
NET10: length 67.5
  Top Layer w0.254: v1(33.17,31.54) 33.86,31.54 U8.18
  Bottom Layer w0.254: NOREF#28.54 46.3,12.31 34.87,23.74 34.87,29.83 v1(33.17,31.54) 21.49,43.22 7.51,43.22 3.63,47.1
NET11: length 53.1
  Top Layer w0.254: v1(45,15.35) 44.75,15.1 44.75,7.23 NOREF#12.53 ; U8.6 44.5,25.71 44.05,25.71 43.03,24.69 v1(43.03,23.68)
  Inner1 w0.254: v1(45,15.35) 42.52,17.83 42.52,21.64 43.28,22.41 43.28,23.42 v1(43.03,23.68)
  Inner2 w0.254: v1(43.03,23.68) 37.44,23.68 30.58,30.53 18.78,30.53 18.02,31.3 18.02,33.19 U1.6
NET12: length 65.2
  Top Layer w0.254: U8.19 33.83,30.24 v1(33.17,30.24)
  Inner1 w0.254: v1(33.17,30.24) 20.11,43.29 4.9,43.29 3.63,44.56
  Bottom Layer w0.254: v1(33.17,30.24) 34.44,28.97 34.44,23.38 45,12.81 NOREF#25.53
NET13: length 50.6
  Top Layer w0.254: v1(43.28,26.53) 44.05,26.53 U8.7 ; v1(43.28,16.21) 43.7,15.79 NOREF#17.52
  Inner1 w0.254: v1(43.28,16.21) 42.01,17.48 42.01,23.57 43.28,24.84 v1(43.28,26.53)
  Inner2 w0.254: v1(43.28,26.53) 32.87,36.94 U1.7
NET14: length 57.7
  Bottom Layer w0.254: 3.63,42.02 9.98,35.67 20.33,35.67 43.7,12.31 NOREF#23.52
NET15: length 54.5
  Top Layer w0.254: U8.8 43.93,28.31 42.66,27.04 v1(42.66,25.77) 42.66,25.01 42.4,24.75 NOREF#34.51
  Inner2 w0.254: v1(42.66,25.77) 43.42,25.77 43.93,26.28 43.93,26.78 31.23,39.48 U1.8
NET16: length 61.7
  Top Layer w0.254: v1(30.63,24.33) 30.63,25.01 33.93,28.31 U8.21
  Inner1 w0.254: 3.63,39.48 7.35,35.76 19.71,35.76 30.63,24.84 v1(30.63,24.33)
  Bottom Layer w0.254: v1(30.63,24.33) 42.4,12.56 NOREF#36.51
NET17: length 59.8
  Top Layer w0.254: NOREF#16.50 41.1,12.81 41.86,13.58 v1(41.86,25.26) 41.86,27.4 44.05,29.58 U8.9
  Inner2 w0.254: U1.9 29.42,42.02 44.4,27.04 44.4,26.02 43.39,25.01 42.12,25.01 v1(41.86,25.26)
NET18: length 47.9
  Top Layer w0.254: v1(41.66,46.66) 41.4,46.91 U3.1 41.4,50.97 42.67,52.24 U3.13
  Inner1 w0.254: v1(41.66,46.66) 41.15,46.15 41.15,13.89 v1(40.64,13.38)
  Bottom Layer w0.254: v1(40.64,13.38) 41.1,12.92 NOREF#4.50
NET19: length 61.5
  Top Layer w0.254: U8.10 44.63,30.77 45.14,30.77 46.15,29.76 v1(46.15,28.05) ; v1(40.31,16.62) 40.31,14.08 40.06,13.83 40.06,7.23 NOREF#10.49
  Inner2 w0.254: 45.9,27.8 v1(46.15,28.05) ; 45.9,27.8 45.9,26.78 46.41,26.28 46.41,22.72 v1(40.31,16.62) ; 45.9,27.8 29.13,44.56 U1.10
NET21: length 63.9
  Top Layer w0.254: U8.11 45.11,32.12 46.38,30.85 v1(46.38,30.59) ; NOREF#15.48 38.5,12.31 39.52,13.32 v1(39.52,14.59)
  Inner2 w0.254: U1.11 29.61,47.1 34.69,42.02 34.95,42.02 v1(46.38,30.59) 46.38,30.09 46.88,29.58 46.88,22.47 44.34,19.93 44.34,19.42 v1(39.52,14.59)
NET22: length 56.1
  Top Layer w0.254: v1(30.63,23.48) 32.91,25.77 U8.23
  Inner1 w0.254: 3.63,34.4 4.9,33.13 20.98,33.13 v1(30.63,23.48)
  Bottom Layer w0.254: v1(30.63,23.48) 38.14,15.97 38.14,7.33 NOREF#21.48
NET23: length 72.9
  Top Layer w0.254: v1(47.11,21.7) 47.11,31.36 45.08,33.39 U8.12 ; NOREF#35.47 37.2,12.05 37.82,12.67 37.82,12.86 37.99,13.02 38.17,13.02 v1(38.73,13.58)
  Inner2 w0.254: v1(38.73,13.58) 39.49,13.58 44.82,18.91 44.82,19.42 v1(47.11,21.7)
  Bottom Layer w0.254: U1.12 19.36,49.52 21.07,49.52 43.53,27.06 arc(43.7,26.94) 43.82,26.77 46.1,24.49 arc(46.21,24.4) 46.3,24.29 46.98,23.61 46.98,21.83 v1(47.11,21.7)
NET24: length 54
  Top Layer w0.254: U8.24 33.93,23.99 v1(33.14,23.99)
  Inner1 w0.254: v1(33.14,23.99) 31.87,22.72 30.34,22.72 22.47,30.59 4.9,30.59 3.63,31.86
  Inner2 w0.254: v1(33.14,23.99) 34.66,22.47 v1(34.66,18.15)
  Bottom Layer w0.254: NOREF#2.47 37.2,15.61 v1(34.66,18.15)
NET25: length 66.8
  Top Layer w0.254: v1(42.75,35.12) 43.06,35.12 43.82,34.36 arc(44.22,34.43) U8.13 ; v1(36.15,39.74) 36.66,39.74 40.17,36.22 v1(40.17,35.62) 40.56,35.24 40.56,33.09 39.46,31.99 39.46,28.92 39.95,28.42 39.95,27.94 38.08,26.06 38.08,23.02 36.25,21.19 36.25,19.18 35.8,18.73 34.38,18.73 34.12,18.48 34.12,18.37 arc(34.08,18.15) 34.12,17.92 34.12,14.14 34.35,13.91 34.86,13.91 35.15,13.62 35.15,13.36 35.66,12.86 35.66,7.59 35.9,7.35 NOREF#33.46
  Bottom Layer w0.254: v1(36.15,39.74) 23.71,52.18 U1.13 ; v1(40.17,35.62) 41.54,35.62 arc(42.2,35.49) v1(42.75,35.12)
NET26: length 51.4
  Top Layer w0.254: v1(32.66,20.12) 32.66,21.89 33.99,23.23 U8.25
  Bottom Layer w0.254: 3.63,29.32 4.96,27.99 24.79,27.99 v1(32.66,20.12) 33.93,18.85 33.93,17.83 35.9,15.86 NOREF#30.46
NET27: length 24.6
  Top Layer w0.254: U1.1 22.28,18.66 28.25,18.66 34.6,12.31 NOREF#5.45
NET28: length 43.2
  Bottom Layer w0.254: 3.63,26.78 4.9,25.51 22.92,25.51 34.6,13.83 NOREF#39.45
NET30: length 18.4
  Top Layer w0.254: v1(28.07,19.32) R1.1
  Bottom Layer w0.254: NOREF#26.44 33.3,14.08 v1(28.07,19.32)
NET31: length 47.5
  Top Layer w0.254: v1(32.13,13.35) 32.13,7.1 NOREF#7.43 ; v1(48.77,39.64) 49.66,40.53 U5.2
  Inner2 w0.254: v1(48.77,39.64) 48.77,20.59 40.77,12.59 32.89,12.59 v1(32.13,13.35)
NET33: length 54.5
  Top Layer w0.254: NOREF#8.42 30.73,7.01 30.73,13.26 29.46,14.53 v1(29.46,15.8) ; U3.11 45.21,53.39 44.45,52.63 44.45,50.6 v1(44.7,50.35)
  Inner1 w0.254: v1(29.46,15.8) 35.05,21.39 35.05,41.71 43.69,50.35 v1(44.7,50.35)
NET34: length 56.8
  Top Layer w0.254: 44.45,48.94 47.75,52.24 48.01,52.24 49.02,53.26 U3.8 ; 44.45,48.94 v1(44.45,49.2) ; 44.45,48.94 44.45,48.69 U3.3
  Inner1 w0.254: v1(44.45,49.2) 43.18,49.2 36.93,42.95 36.93,21.36 v1(30.48,14.91)
  Bottom Layer w0.254: NOREF#14.42 30.7,14.69 v1(30.48,14.91)
NET38: length 61.9
  Top Layer w0.254: U3.4 45.21,46.91 v1(44.96,46.66)
  Inner1 w0.254: v1(29.97,13.16) 31.02,12.11 45.72,12.11 47.24,13.64 47.24,14.14 46.48,14.91 46.48,24.56 44.45,26.59 44.45,46.15 v1(44.96,46.66)
  Bottom Layer w0.254: NOREF#9.40 28.19,7.07 28.19,12.4 28.96,13.16 v1(29.97,13.16)
$1N1759: length 25
  Top Layer w0.254: U4.5 36.72,41.64 35.45,40.37 35.45,37.83 36.72,36.56 36.72,23.73 34.94,21.95 34.45,21.95 U8.26
$1N1852: length 35.2
  Top Layer w0.254: v1(43.21,21.33) 42.96,21.07 42.96,20.56 44.1,19.42 U8.1 ; v1(43.72,43.68) 37.37,50.03 U4.9
  Inner1 w0.254: v1(43.72,43.68) 43.97,43.42 43.97,22.09 v1(43.21,21.33)
$1N2115: length 17.7
  Top Layer w0.254: 36.58,45.7 36.58,50.39 U4.10 ; 36.58,45.7 36.07,45.19 U4.4 36.07,44.18 35.56,43.67 34.63,43.67 34.12,44.18 U4.1 ; 36.58,45.7 40.25,45.7 R3.1
$1N2536: length 35.4
  Top Layer w0.254: v1(33.17,26.57) 33.98,26.57 U8.22 ; v1(45.21,51.62) 46.48,52.89 U3.10
  Inner1 w0.254: v1(33.17,26.57) 34.29,27.69 34.29,42.98 42.93,51.62 v1(45.21,51.62)
$1N2667: length 30.4
  Top Layer w0.254: U4.3 35.42,45.57 36.07,46.22 U4.11 36.07,51.04 36.58,51.55 40.82,51.55 42.09,52.82 42.09,54.6 42.6,55.11 49.2,55.11 49.71,54.6 49.71,52.82 47.75,50.86 U3.6
$1N3512: length 3.9
  Top Layer w0.254: R4.2 47.54,38.44 U5.4
$1N3520: length 15.9
  Top Layer w0.254: R3.2 45.47,42.55 45.47,42.59 ; 45.47,42.59 R4.1 ; 45.47,42.59 45.47,43.86 42.67,46.66 U3.2 42.67,50.97 43.94,52.24 U3.12
$1N5475: length 39.6
  Top Layer w0.254: v1(45.97,51.36) 47.75,53.14 U3.9 ; U8.27 34.86,20.69 37.34,23.17 37.34,37.9 v1(36.32,38.92)
  Bottom Layer w0.254: v1(36.32,38.92) 45.97,48.57 v1(45.97,51.36)

## Copper pours and planes (outline as drawn; the poured copper is in the pictures)
GND on Top Layer: -4.95,64.76 56.64,64.76 56.64,11.16 -4.95,11.16
GND on Bottom Layer: -5.84,69.07 55.37,69.07 55.37,11.16 -5.84,11.16

## Text on the board
Top Silkscreen Layer: FRAM | 28C256
